# EAGLE board reg-board (EAGLE 7.6.0), part 1 of 2
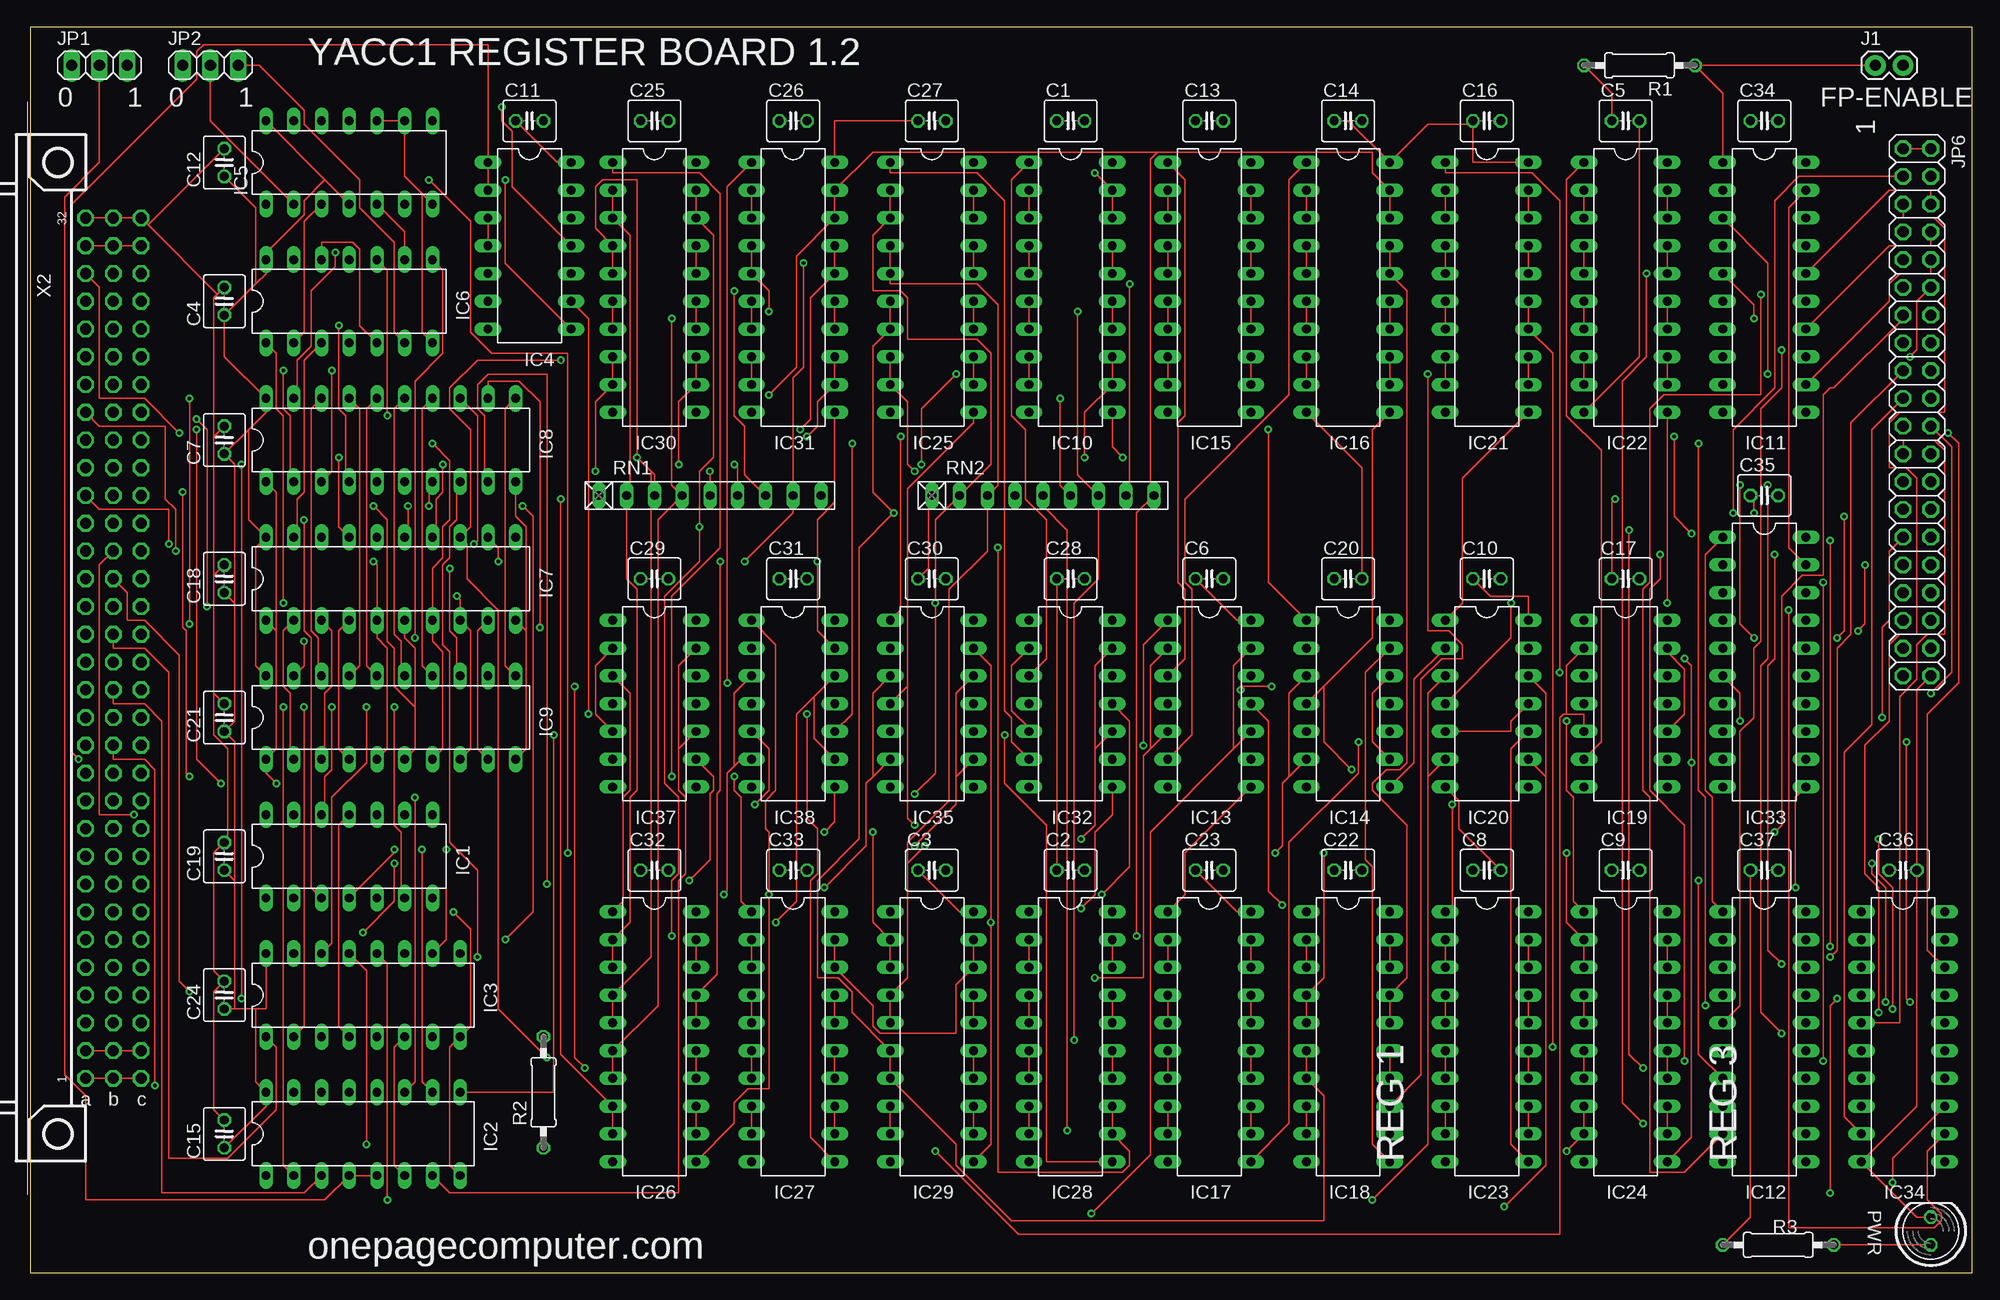
[diagram p5: board, top side]
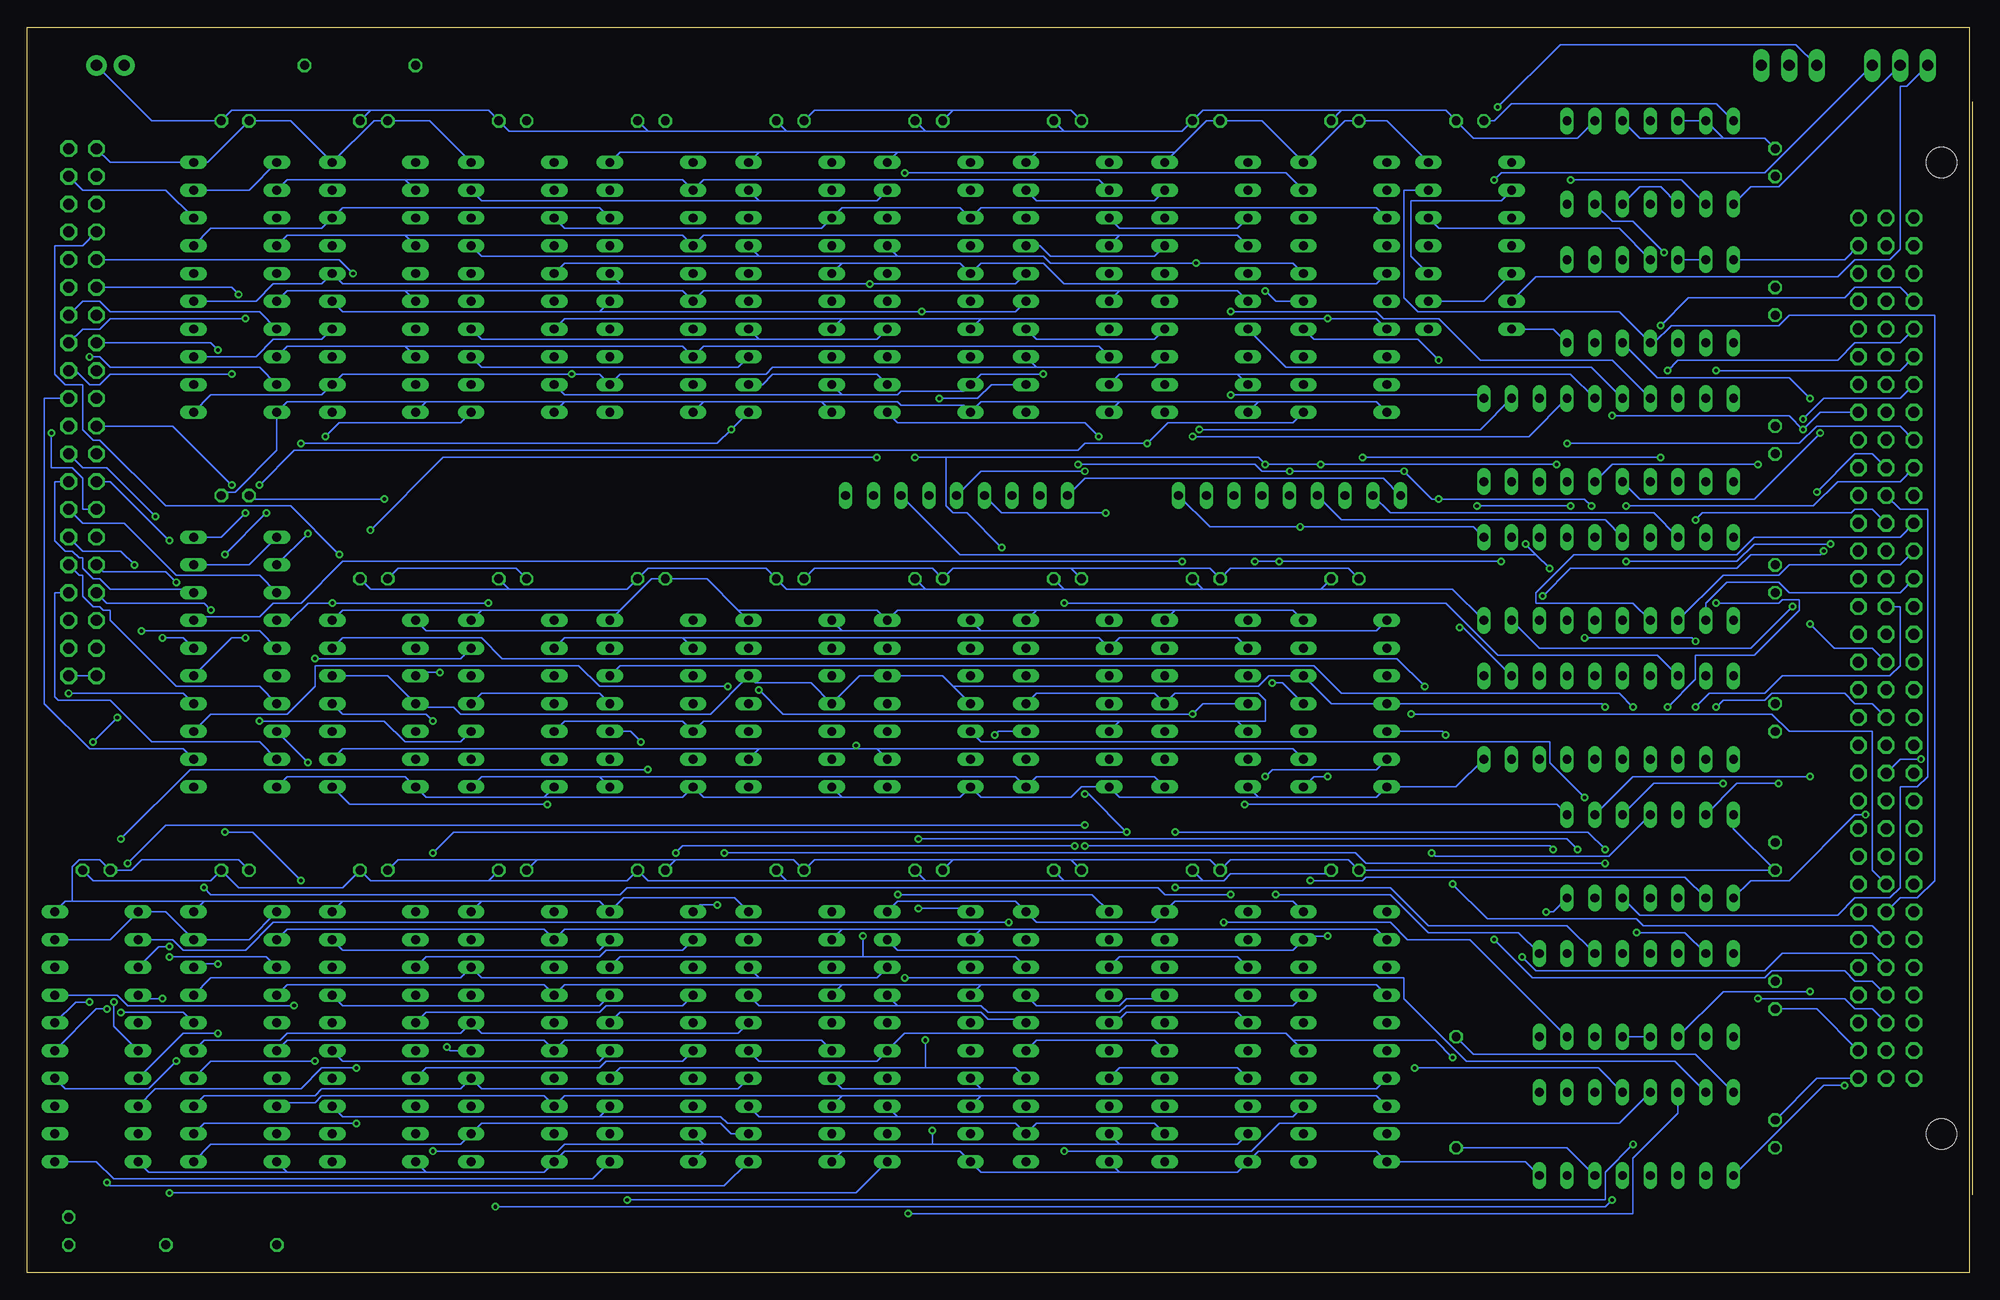
[diagram p6: board, bottom side, seen from below]

Size 177.78 x 113.97 mm. Coordinates in mm from the lower left corner, seen from the top.
Outline: 0,0 177.78,0 177.78,113.97 0,113.97 0,0
Copper layers (1*16): Top 0.0356mm / dielectric 1.5011mm / Bottom 0.0356mm
Design rules "LaenPCBOrder *": minimum track width 6mil, minimum drill 13mil, track to track 8mil, track to pad 8mil, pad to pad 8mil, via to via 8mil, smd to smd 6mil, copper to edge 40mil, drill to drill 8mil, minimum pad ring 7mil, minimum via ring 7mil, stop-mask expansion 3mil, vias tented up to drill 0mil, thermal gap 10mil
Net classes: 1 GND: width 1 mm; 2 5V: width 1 mm

## Footprints (pad centres in the part's own frame; a part is rotated, then mirrored left to right if it is on the bottom)
C025-040X050 = drill 0.813 octagon: 1 -1.27,0; 2 1.27,0
DIL14 = drill 0.813 long: 1 -7.62,-3.81; 2 -5.08,-3.81; 3 -2.54,-3.81; 4 0,-3.81; 5 2.54,-3.81; 6 5.08,-3.81; 7 7.62,-3.81; 8 7.62,3.81; 9 5.08,3.81; 10 2.54,3.81; 11 0,3.81; 12 -2.54,3.81; 13 -5.08,3.81; 14 -7.62,3.81
DIL16 = drill 0.813 long: 1 -8.89,-3.81; 2 -6.35,-3.81; 3 -3.81,-3.81; 4 -1.27,-3.81; 5 1.27,-3.81; 6 3.81,-3.81; 7 6.35,-3.81; 8 8.89,-3.81; 9 8.89,3.81; 10 6.35,3.81; 11 3.81,3.81; 12 1.27,3.81; 13 -1.27,3.81; 14 -3.81,3.81; 15 -6.35,3.81; 16 -8.89,3.81
DIL20 = drill 0.813 long: 1 -11.43,-3.81; 2 -8.89,-3.81; 3 -6.35,-3.81; 4 -3.81,-3.81; 5 -1.27,-3.81; 6 1.27,-3.81; 7 3.81,-3.81; 8 6.35,-3.81; 9 8.89,-3.81; 10 11.43,-3.81; 11 11.43,3.81; 12 8.89,3.81; 13 6.35,3.81; 14 3.81,3.81; 15 1.27,3.81; 16 -1.27,3.81; 17 -3.81,3.81; 18 -6.35,3.81; 19 -8.89,3.81; 20 -11.43,3.81
1X02 = drill 1.016 pad 1.88: 1 0,0; 2 2.54,0
1X03 = drill 1.016 long: 1 -2.54,0; 2 0,0; 3 2.54,0
2X20 = drill 1.016 octagon: 1 -24.13,-1.27; 2 -24.13,1.27; 3 -21.59,-1.27; 4 -21.59,1.27; 5 -19.05,-1.27; 6 -19.05,1.27; 7 -16.51,-1.27; 8 -16.51,1.27; 9 -13.97,-1.27; 10 -13.97,1.27; 11 -11.43,-1.27; 12 -11.43,1.27; 13 -8.89,-1.27; 14 -8.89,1.27; 15 -6.35,-1.27; 16 -6.35,1.27; 17 -3.81,-1.27; 18 -3.81,1.27; 19 -1.27,-1.27; 20 -1.27,1.27; 21 1.27,-1.27; 22 1.27,1.27; 23 3.81,-1.27; 24 3.81,1.27; 25 6.35,-1.27; 26 6.35,1.27; 27 8.89,-1.27; 28 8.89,1.27; 29 11.43,-1.27; 30 11.43,1.27; 31 13.97,-1.27; 32 13.97,1.27; 33 16.51,-1.27; 34 16.51,1.27; 35 19.05,-1.27; 36 19.05,1.27; 37 21.59,-1.27; 38 21.59,1.27; 39 24.13,-1.27; 40 24.13,1.27
LED5MM = drill 0.813 octagon: A -1.27,0; K 1.27,0
0207/10 = drill 0.813 octagon: 1 -5.08,0; 2 5.08,0
RN-9 = drill 0.813 long: 1 -10.16,0; 2 -7.62,0; 3 -5.08,0; 4 -2.54,0; 5 0,0; 6 2.54,0; 7 5.08,0; 8 7.62,0; 9 10.16,0
FABC96R = drill 1.016 octagon: A1 -2.54,39.37; A2 -2.54,36.83; A3 -2.54,34.29; A4 -2.54,31.75; A5 -2.54,29.21; A6 -2.54,26.67; A7 -2.54,24.13; A8 -2.54,21.59; A9 -2.54,19.05; A10 -2.54,16.51; A11 -2.54,13.97; A12 -2.54,11.43; A13 -2.54,8.89; A14 -2.54,6.35; A15 -2.54,3.81; A16 -2.54,1.27; A17 -2.54,-1.27; A18 -2.54,-3.81; A19 -2.54,-6.35; A20 -2.54,-8.89; A21 -2.54,-11.43; A22 -2.54,-13.97; A23 -2.54,-16.51; A24 -2.54,-19.05; A25 -2.54,-21.59; A26 -2.54,-24.13; A27 -2.54,-26.67; A28 -2.54,-29.21; A29 -2.54,-31.75; A30 -2.54,-34.29; A31 -2.54,-36.83; A32 -2.54,-39.37; B1 -5.08,39.37; B2 -5.08,36.83; B3 -5.08,34.29; B4 -5.08,31.75; B5 -5.08,29.21; B6 -5.08,26.67; B7 -5.08,24.13; B8 -5.08,21.59; B9 -5.08,19.05; B10 -5.08,16.51; B11 -5.08,13.97; B12 -5.08,11.43; B13 -5.08,8.89; B14 -5.08,6.35; B15 -5.08,3.81; B16 -5.08,1.27; B17 -5.08,-1.27; B18 -5.08,-3.81; B19 -5.08,-6.35; B20 -5.08,-8.89; B21 -5.08,-11.43; B22 -5.08,-13.97; B23 -5.08,-16.51; B24 -5.08,-19.05; B25 -5.08,-21.59; B26 -5.08,-24.13; B27 -5.08,-26.67; B28 -5.08,-29.21; B29 -5.08,-31.75; B30 -5.08,-34.29; B31 -5.08,-36.83; B32 -5.08,-39.37; C1 -7.62,39.37; C2 -7.62,36.83; C3 -7.62,34.29; C4 -7.62,31.75; C5 -7.62,29.21; C6 -7.62,26.67; C7 -7.62,24.13; C8 -7.62,21.59; C9 -7.62,19.05; C10 -7.62,16.51; C11 -7.62,13.97; C12 -7.62,11.43; C13 -7.62,8.89; C14 -7.62,6.35; C15 -7.62,3.81; C16 -7.62,1.27; C17 -7.62,-1.27; C18 -7.62,-3.81; C19 -7.62,-6.35; C20 -7.62,-8.89; C21 -7.62,-11.43; C22 -7.62,-13.97; C23 -7.62,-16.51; C24 -7.62,-19.05; C25 -7.62,-21.59; C26 -7.62,-24.13; C27 -7.62,-26.67; C28 -7.62,-29.21; C29 -7.62,-31.75; C30 -7.62,-34.29; C31 -7.62,-36.83; C32 -7.62,-39.37 | hole 2.794: 0,-44.456; 0,44.456

## Placement (x,y rotation side)
C1  [C025-040X050]  95.25,105.41 0 top
C2  [C025-040X050]  95.25,36.83 0 top
C3  [C025-040X050]  82.55,36.83 0 top
C4  [C025-040X050]  17.78,88.9 90 top
C5  [C025-040X050]  146.05,105.41 0 top
C6  [C025-040X050]  107.95,63.5 0 top
C7  [C025-040X050]  17.78,76.2 90 top
C8  [C025-040X050]  133.35,36.83 0 top
C9  [C025-040X050]  146.05,36.83 0 top
C10  [C025-040X050]  133.35,63.5 0 top
C11  [C025-040X050]  45.72,105.41 0 top
C12  [C025-040X050]  17.78,101.6 90 top
C13  [C025-040X050]  107.95,105.41 0 top
C14  [C025-040X050]  120.65,105.41 0 top
C15  [C025-040X050]  17.78,12.7 90 top
C16  [C025-040X050]  133.35,105.41 0 top
C17  [C025-040X050]  146.05,63.5 0 top
C18  [C025-040X050]  17.78,63.5 90 top
C19  [C025-040X050]  17.78,38.1 90 top
C20  [C025-040X050]  120.65,63.5 0 top
C21  [C025-040X050]  17.78,50.8 90 top
C22  [C025-040X050]  120.65,36.83 0 top
C23  [C025-040X050]  107.95,36.83 0 top
C24  [C025-040X050]  17.78,25.4 90 top
C25  [C025-040X050]  57.15,105.41 0 top
C26  [C025-040X050]  69.85,105.41 0 top
C27  [C025-040X050]  82.55,105.41 0 top
C28  [C025-040X050]  95.25,63.5 0 top
C29  [C025-040X050]  57.15,63.5 0 top
C30  [C025-040X050]  82.55,63.5 0 top
C31  [C025-040X050]  69.85,63.5 0 top
C32  [C025-040X050]  57.15,36.83 0 top
C33  [C025-040X050]  69.85,36.83 0 top
C34  [C025-040X050]  158.75,105.41 0 top
C35  [C025-040X050]  158.75,71.12 0 top
C36  [C025-040X050]  171.45,36.83 0 top
C37  [C025-040X050]  158.75,36.83 0 top
IC1  74LS04N  [DIL14]  29.21,38.1 0 top
IC2  74LS138N  [DIL16]  30.48,12.7 0 top
IC3  74LS138N  [DIL16]  30.48,25.4 0 top
IC4  74LS00N  [DIL14]  45.72,93.98 270 top
IC5  74LS86N  [DIL14]  29.21,101.6 0 top
IC6  74LS00N  [DIL14]  29.21,88.9 0 top
IC7  74LS245N  [DIL20]  33.02,63.5 0 top
IC8  74LS245N  [DIL20]  33.02,76.2 0 top
IC9  74LS245N  [DIL20]  33.02,50.8 0 top
IC10  74S374N  [DIL20]  95.25,90.17 270 top
IC11  74LS244N  [DIL20]  158.75,90.17 270 top
IC12  74LS244N  [DIL20]  158.75,21.59 270 top
IC13  7432N  [DIL14]  107.95,52.07 270 top
IC14  74LS02N  [DIL14]  120.65,52.07 270 top
IC15  74S374N  [DIL20]  107.95,90.17 270 top
IC16  74S374N  [DIL20]  120.65,90.17 270 top
IC17  74S374N  [DIL20]  107.95,21.59 270 top
IC18  74S374N  [DIL20]  120.65,21.59 270 top
IC19  7432N  [DIL14]  146.05,52.07 270 top
IC20  74LS02N  [DIL14]  133.35,52.07 270 top
IC21  74S374N  [DIL20]  133.35,90.17 270 top
IC22  74S374N  [DIL20]  146.05,90.17 270 top
IC23  74S374N  [DIL20]  133.35,21.59 270 top
IC24  74S374N  [DIL20]  146.05,21.59 270 top
IC25  74S374N  [DIL20]  82.55,90.17 270 top
IC26  74S374N  [DIL20]  57.15,21.59 270 top
IC27  74S374N  [DIL20]  69.85,21.59 270 top
IC28  74S374N  [DIL20]  95.25,21.59 270 top
IC29  74S374N  [DIL20]  82.55,21.59 270 top
IC30  74S374N  [DIL20]  57.15,90.17 270 top
IC31  74S374N  [DIL20]  69.85,90.17 270 top
IC32  7432N  [DIL14]  95.25,52.07 270 top
IC33  74LS244N  [DIL20]  158.75,55.88 270 top
IC34  74LS244N  [DIL20]  171.45,21.59 270 top
IC35  74LS02N  [DIL14]  82.55,52.07 270 top
IC37  7432N  [DIL14]  57.15,52.07 270 top
IC38  74LS02N  [DIL14]  69.85,52.07 270 top
J1  [1X02]  168.91,110.49 0 top
JP1  [1X03]  6.35,110.49 0 top
JP2  [1X03]  16.51,110.49 0 top
JP6  [2X20]  172.72,78.74 270 top
PWR  [LED5MM]  173.99,3.81 90 top
R1  10k  [0207/10]  147.32,110.49 180 top
R2  10k  [0207/10]  46.99,16.51 90 top
R3  330  [0207/10]  160.02,2.54 180 top
RN1  [RN-9]  62.23,71.12 0 top
RN2  [RN-9]  92.71,71.12 0 top
X2  FABC96R  [FABC96R]  2.54,57.15 180 top